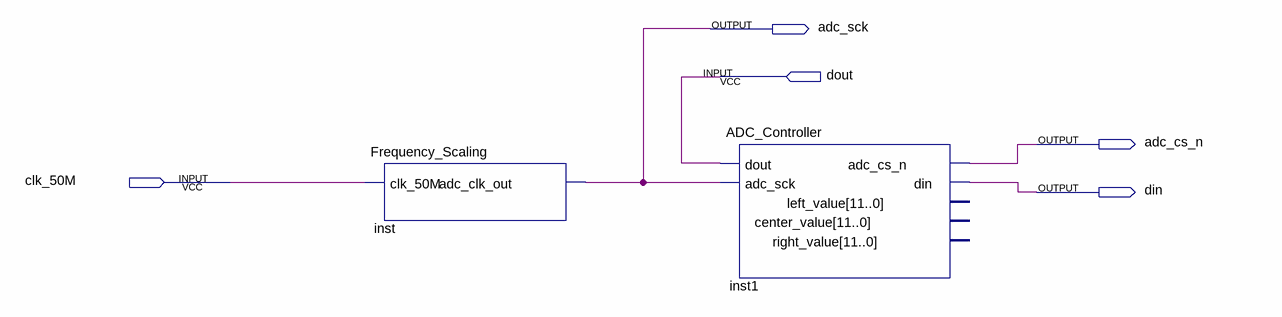
[diagram p0: schematic sheet]
// Quartus schematic AB_LFA_Tester.bdf as structural Verilog: 2 symbols, 5 pins
module AB_LFA_Tester (
  input  dout,
  input  clk_50M,
  output adc_sck,
  output adc_cs_n,
  output din
);

  Frequency_Scaling inst (.clk_50M(clk_50M), .adc_clk_out(adc_sck));
  ADC_Controller inst1 (
    .dout(dout), .adc_sck(adc_sck), .adc_cs_n(adc_cs_n), .din(din));  // open: left_value, center_value, right_value
endmodule
